# EAGLE design Sensor Acquisition Board Rear rev2 (EAGLE 9.6.2)

## Sheet 1 of 2
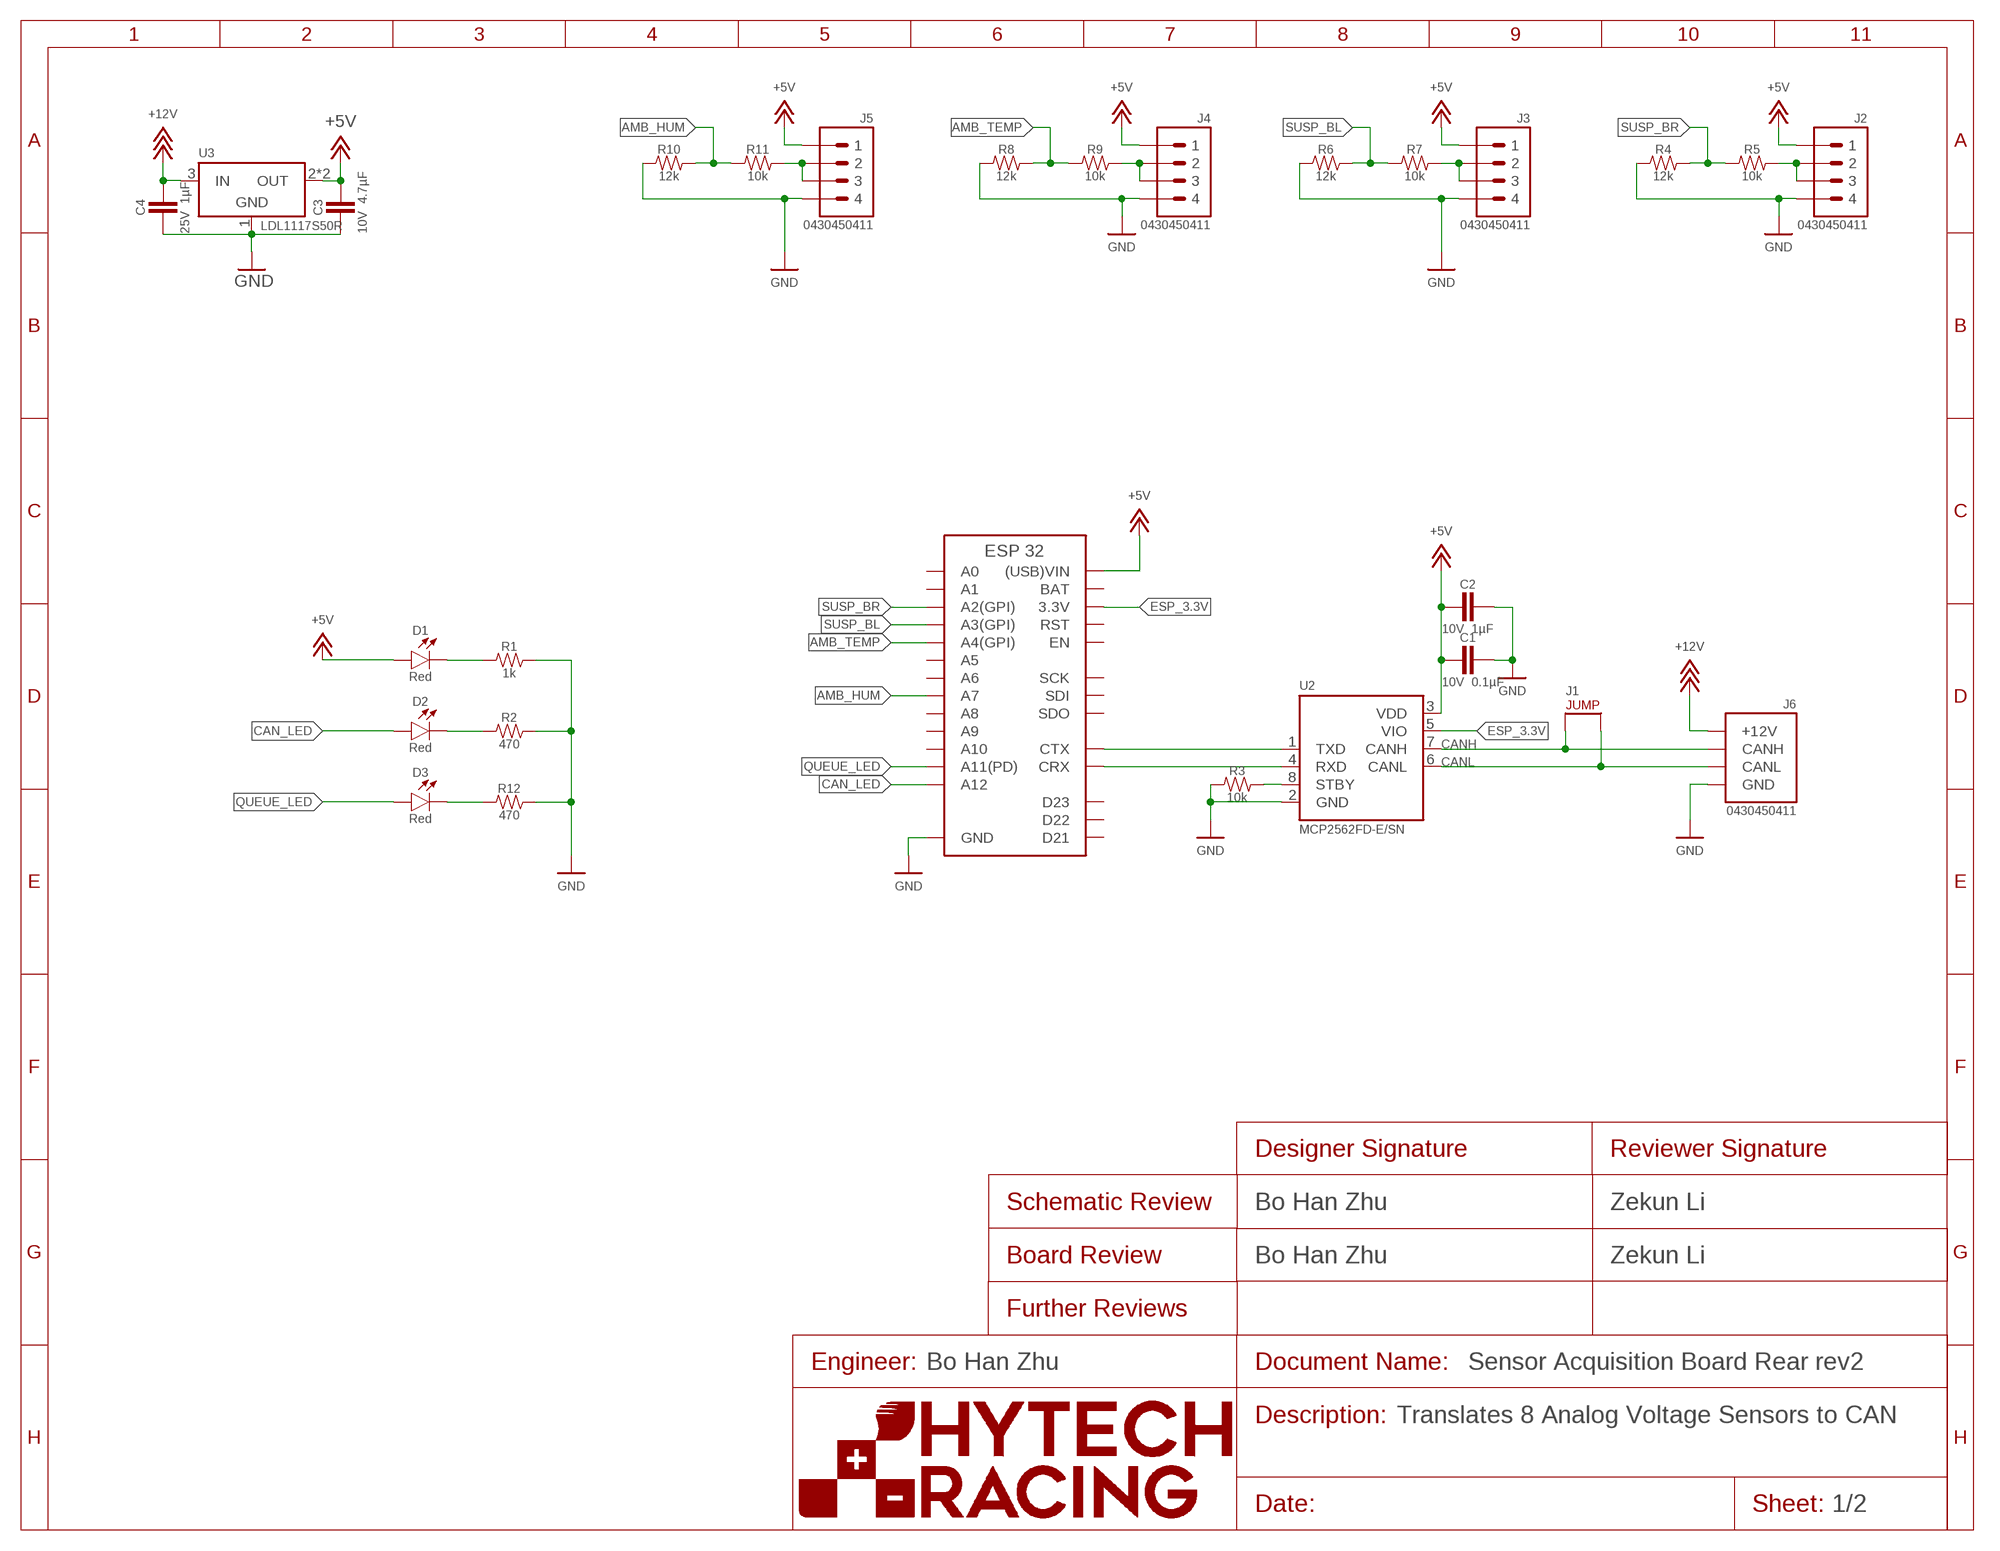
[diagram p0: schematic, sheet 1]
FRAME1 (FRAME): DESCRIPTION_1: Translates 8 Analog Voltage Sensors to CAN; DESIGNER_BOARD: Bo Han Zhu; DESIGNER_SCHEMATIC: Bo Han Zhu; ENGINEER: Bo Han Zhu; REVIEWER_BOARD: Zekun Li; REVIEWER_SCHEMATIC: Zekun Li

### Parts
A2  ESP32  [ESP32]
C1  CAPACITOR_0603_10V_0.1UF  [0603-CAP]
C2  CAPACITOR_0603_10V_1UF  [0603-CAP]
C3  CAPACITOR_0603_10V_4.7UF  [0603-CAP]
C4  CAPACITOR_0603_25V_1UF  [0603-CAP]
D1  LED_0603_RED  [0603-LED]
D2  LED_0603_RED  [0603-LED]
D3  LED_0603_RED  [0603-LED]
J1  JUMPER_0603_  [0603-RES]
J2  CONNECTOR-4_μF_S_RA_  [MOLEX_MICROFIT_SMD_RIGHTANGLE_04_DUAL]
J3  CONNECTOR-4_μF_S_RA_  [MOLEX_MICROFIT_SMD_RIGHTANGLE_04_DUAL]
J4  CONNECTOR-4_μF_S_RA_  [MOLEX_MICROFIT_SMD_RIGHTANGLE_04_DUAL]
J5  CONNECTOR-4_μF_S_RA_  [MOLEX_MICROFIT_SMD_RIGHTANGLE_04_DUAL]
J6  CONNECTOR-CAN_μF_S_RA_  [MOLEX_MICROFIT_SMD_RIGHTANGLE_04_DUAL]
R1  RESISTOR_0603_1K  [0603-RES]
R2  RESISTOR_0603_470  [0603-RES]
R3  RESISTOR_0603_10K  [0603-RES]
R4  RESISTOR_0603_12K  [0603-RES]
R5  RESISTOR_0603_10K  [0603-RES]
R6  RESISTOR_0603_12K  [0603-RES]
R7  RESISTOR_0603_10K  [0603-RES]
R8  RESISTOR_0603_12K  [0603-RES]
R9  RESISTOR_0603_10K  [0603-RES]
R10  RESISTOR_0603_12K  [0603-RES]
R11  RESISTOR_0603_10K  [0603-RES]
R12  RESISTOR_0603_470  [0603-RES]
U2  MCP2562FD  [SOIC-08(NARROW,0.15")]
U3  VOLTAGE_REGULATOR_SOT-223_5V  [SOT-223]

### Nets
+5V: A2.USB((USB)VIN) C1.2 C2.2 C3.1 D1.2(A) J2.1 J3.1 J4.1 J5.1 U2.3(VDD) U3.2(OUT) U3.4(OUT)
+12V: C4.1 J6.1(+12V) U3.3(IN)
AMB_HUM: A2.D32(A7) R10.2 R11.1
AMB_TEMP: A2.A4(A4(GPI)) R8.2 R9.1
CAN_LED: A2.D13(A12) D2.2(A)
CANH: J1.1 J6.4(CANH) U2.7(CANH)
CANL: J1.2 J6.3(CANL) U2.6(CANL)
ESP_3.3V: A2.3.3V U2.5(VIO)
GND: A2.GND C1.1 C2.1 C3.2 C4.2 J2.4 J3.4 J4.4 J5.4 J6.2(GND) R1.2 R2.2 R3.1 R4.1 R6.1 R8.1 R10.1 R12.2 U2.2(GND) U3.1(GND)
N$1: D1.1(C) R1.1
N$2: D2.1(C) R2.1
N$3: R3.2 U2.8(STBY)
N$4: A2.TX(CTX) U2.1(TXD)
N$5: J2.2 J2.3 R5.2
N$6: J4.2 J4.3 R9.2
N$7: J3.2 J3.3 R7.2
N$8: A2.RX(CRX) U2.4(RXD)
N$9: J5.2 J5.3 R11.2
N$10: D3.1(C) R12.1
QUEUE_LED: A2.D12(A11(PD)) D3.2(A)
SUSP_BL: A2.A3(A3(GPI)) R6.2 R7.1
SUSP_BR: A2.A2(A2(GPI)) R4.2 R5.1
Unconnected: A2.A0 A2.A1 A2.A5 A2.CIPO(SDI) A2.COPI(SDO) A2.D14(A6) A2.D15(A8) A2.D21 A2.D27(A10) A2.D33(A9) A2.SCK A2.SCL(D23) A2.SDA(D22)

## Sheet 2 of 2
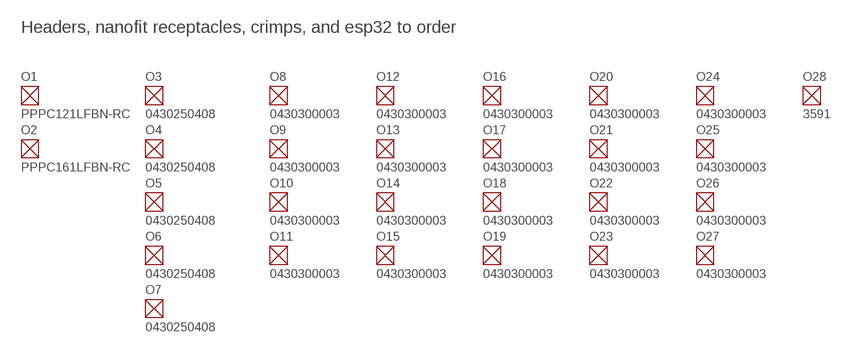
[diagram p1: schematic, sheet 2]
O1 (HEADER_FEMALE_PINS_12_0.1"_PITCH): DKPN: S7045-ND; MANUFACTURER: Sullins Connector Solutions; MPN: PPPC121LFBN-RC
O2 (HEADER_FEMALE_PINS_16_0.1"_PITCH): DKPN: S7049-ND; MANUFACTURER: Sullins Connector Solutions; MPN: PPPC161LFBN-RC
O3 (RECEPTACLE-4_MICROFIT): DKPN: WM11225-ND; MANUFACTURER: Molex; MOPN: 538-43025-0408; MPN: 0430250408
O4 (RECEPTACLE-4_MICROFIT): DKPN: WM11225-ND; MANUFACTURER: Molex; MOPN: 538-43025-0408; MPN: 0430250408
O5 (RECEPTACLE-4_MICROFIT): DKPN: WM11225-ND; MANUFACTURER: Molex; MOPN: 538-43025-0408; MPN: 0430250408
O6 (RECEPTACLE-4_MICROFIT): DKPN: WM11225-ND; MANUFACTURER: Molex; MOPN: 538-43025-0408; MPN: 0430250408
O7 (RECEPTACLE-4_MICROFIT): DKPN: WM11225-ND; MANUFACTURER: Molex; MOPN: 538-43025-0408; MPN: 0430250408
O8 (CRIMP_MICROFIT_20-24): DKPN: WM2776CT-ND; GAUGE: 20-24; MANUFACTURER: Molex; MOPN: 538-43030-0003; MPN: 0430300003
O9 (CRIMP_MICROFIT_20-24): DKPN: WM2776CT-ND; GAUGE: 20-24; MANUFACTURER: Molex; MOPN: 538-43030-0003; MPN: 0430300003
O10 (CRIMP_MICROFIT_20-24): DKPN: WM2776CT-ND; GAUGE: 20-24; MANUFACTURER: Molex; MOPN: 538-43030-0003; MPN: 0430300003
O11 (CRIMP_MICROFIT_20-24): DKPN: WM2776CT-ND; GAUGE: 20-24; MANUFACTURER: Molex; MOPN: 538-43030-0003; MPN: 0430300003
O12 (CRIMP_MICROFIT_20-24): DKPN: WM2776CT-ND; GAUGE: 20-24; MANUFACTURER: Molex; MOPN: 538-43030-0003; MPN: 0430300003
O13 (CRIMP_MICROFIT_20-24): DKPN: WM2776CT-ND; GAUGE: 20-24; MANUFACTURER: Molex; MOPN: 538-43030-0003; MPN: 0430300003
O14 (CRIMP_MICROFIT_20-24): DKPN: WM2776CT-ND; GAUGE: 20-24; MANUFACTURER: Molex; MOPN: 538-43030-0003; MPN: 0430300003
O15 (CRIMP_MICROFIT_20-24): DKPN: WM2776CT-ND; GAUGE: 20-24; MANUFACTURER: Molex; MOPN: 538-43030-0003; MPN: 0430300003
O16 (CRIMP_MICROFIT_20-24): DKPN: WM2776CT-ND; GAUGE: 20-24; MANUFACTURER: Molex; MOPN: 538-43030-0003; MPN: 0430300003
O17 (CRIMP_MICROFIT_20-24): DKPN: WM2776CT-ND; GAUGE: 20-24; MANUFACTURER: Molex; MOPN: 538-43030-0003; MPN: 0430300003
O18 (CRIMP_MICROFIT_20-24): DKPN: WM2776CT-ND; GAUGE: 20-24; MANUFACTURER: Molex; MOPN: 538-43030-0003; MPN: 0430300003
O19 (CRIMP_MICROFIT_20-24): DKPN: WM2776CT-ND; GAUGE: 20-24; MANUFACTURER: Molex; MOPN: 538-43030-0003; MPN: 0430300003
O20 (CRIMP_MICROFIT_20-24): DKPN: WM2776CT-ND; GAUGE: 20-24; MANUFACTURER: Molex; MOPN: 538-43030-0003; MPN: 0430300003
O21 (CRIMP_MICROFIT_20-24): DKPN: WM2776CT-ND; GAUGE: 20-24; MANUFACTURER: Molex; MOPN: 538-43030-0003; MPN: 0430300003
O22 (CRIMP_MICROFIT_20-24): DKPN: WM2776CT-ND; GAUGE: 20-24; MANUFACTURER: Molex; MOPN: 538-43030-0003; MPN: 0430300003
O23 (CRIMP_MICROFIT_20-24): DKPN: WM2776CT-ND; GAUGE: 20-24; MANUFACTURER: Molex; MOPN: 538-43030-0003; MPN: 0430300003
O24 (CRIMP_MICROFIT_20-24): DKPN: WM2776CT-ND; GAUGE: 20-24; MANUFACTURER: Molex; MOPN: 538-43030-0003; MPN: 0430300003
O25 (CRIMP_MICROFIT_20-24): DKPN: WM2776CT-ND; GAUGE: 20-24; MANUFACTURER: Molex; MOPN: 538-43030-0003; MPN: 0430300003
O26 (CRIMP_MICROFIT_20-24): DKPN: WM2776CT-ND; GAUGE: 20-24; MANUFACTURER: Molex; MOPN: 538-43030-0003; MPN: 0430300003
O27 (CRIMP_MICROFIT_20-24): DKPN: WM2776CT-ND; GAUGE: 20-24; MANUFACTURER: Molex; MOPN: 538-43030-0003; MPN: 0430300003
O28 (ESP32): DKPN: 1528-2514-ND; MANUFACTURER: Adafruit Industries LLC; MPN: 3591

### Notes on the sheet
- Headers, nanofit receptacles, crimps, and esp32 to order

## Power pins joined to a net without a drawn wire
BAT: A2.BAT
EN: A2.EN
RST: A2.RST

## Library data of the parts
A2 = HyTechDevicesTemp:ESP32: ESP32 Datasheet <https://cdn-learn.adafruit.com/downloads/pdf/adafruit-huzzah32-esp32-feather.pdf> Requires ordering of: 1: 12 pin, 0.1" pitch female headers 1: 16 pin, 0.1" pitch female headers
C1 = HyTechDevices:CAPACITOR_?_*: Capacitor, Non-Polarized VJ...1BC Series Datasheet <https://www.mouser.com/datasheet/2/427/vjw1bcbascomseries-1762447.pdf> Samsung Datasheet <https://www.mouser.com/datasheet/2/585/MLCC-1837944.pdf> Walsin Datasheet <https://www.mouser.com/datasheet/2/210/WTC_MLCC_General_Purpose-1534899.pdf> GRM188R61A226ME15D <https://www.mouser.com/datasheet/2/281/1/GRM188R61A226ME15_02A-1985787.pdf> GRM188R61E106MA73D <https://www.mouser.com/datasheet/2/281/1/GRM188R61E106MA73_01A-1985806.pdf> 885012006013 <https://www.mouser.com/datasheet/2/445/885012006013-1726946.pdf> 2220Y6300105KXTWS2 <https://www.mouser.com/datasheet/2/218/SMD_High_and_Std_StackiCap_P62-1825512.pdf> Yageo Class 2, X5R <https://www.mouser.com/datasheet/2/447/UPY_GPHC_X5R_4V_to_50V_26-1827097.pdf> TDK C Series <https://www.mouser.com/ProductDetail/TDK/C3216X5R1V226M160AC?qs=%2Fha2pyFadujbcx9jh7lYl%2F4NeMoXFhdc8AqVWNq4wW6M2y7zl6GzBuhgtI0ngznN> AVX Automotive MLCC <https://www.mouser.com/datasheet/2/40/AutoMLCC-777028.pdf> KEMET X7R Series <https://www.mouser.com/datasheet/2/212/KEM_C1002_X7R_SMD-1102033.pdf> Kyocera AVX <https://www.mouser.com/datasheet/2/40/C0GNP0_Dielectric-951274.pdf>; CAPACITANCE: 0.1µF; DKPN: 720-1688-1-ND; MANUFACTURER: Vishay Vitramon; MOPN: 77-VJ0603Y104JXQPBC; MPN: VJ0603Y104JXQPW1BC; TOLERANCE: 5%; VOLTAGE: 10V
C2 = HyTechDevices:CAPACITOR_?_*: Capacitor, Non-Polarized VJ...1BC Series Datasheet <https://www.mouser.com/datasheet/2/427/vjw1bcbascomseries-1762447.pdf> Samsung Datasheet <https://www.mouser.com/datasheet/2/585/MLCC-1837944.pdf> Walsin Datasheet <https://www.mouser.com/datasheet/2/210/WTC_MLCC_General_Purpose-1534899.pdf> GRM188R61A226ME15D <https://www.mouser.com/datasheet/2/281/1/GRM188R61A226ME15_02A-1985787.pdf> GRM188R61E106MA73D <https://www.mouser.com/datasheet/2/281/1/GRM188R61E106MA73_01A-1985806.pdf> 885012006013 <https://www.mouser.com/datasheet/2/445/885012006013-1726946.pdf> 2220Y6300105KXTWS2 <https://www.mouser.com/datasheet/2/218/SMD_High_and_Std_StackiCap_P62-1825512.pdf> Yageo Class 2, X5R <https://www.mouser.com/datasheet/2/447/UPY_GPHC_X5R_4V_to_50V_26-1827097.pdf> TDK C Series <https://www.mouser.com/ProductDetail/TDK/C3216X5R1V226M160AC?qs=%2Fha2pyFadujbcx9jh7lYl%2F4NeMoXFhdc8AqVWNq4wW6M2y7zl6GzBuhgtI0ngznN> AVX Automotive MLCC <https://www.mouser.com/datasheet/2/40/AutoMLCC-777028.pdf> KEMET X7R Series <https://www.mouser.com/datasheet/2/212/KEM_C1002_X7R_SMD-1102033.pdf> Kyocera AVX <https://www.mouser.com/datasheet/2/40/C0GNP0_Dielectric-951274.pdf>; CAPACITANCE: 1µF; DKPN: 311-1796-1-ND; MANUFACTURER: Yageo; MOPN: 603-CC603KRX7R6BB105; MPN: CC0603KRX7R6BB105; TOLERANCE: 10%; VOLTAGE: 10V
C3 = HyTechDevices:CAPACITOR_?_*: Capacitor, Non-Polarized VJ...1BC Series Datasheet <https://www.mouser.com/datasheet/2/427/vjw1bcbascomseries-1762447.pdf> Samsung Datasheet <https://www.mouser.com/datasheet/2/585/MLCC-1837944.pdf> Walsin Datasheet <https://www.mouser.com/datasheet/2/210/WTC_MLCC_General_Purpose-1534899.pdf> GRM188R61A226ME15D <https://www.mouser.com/datasheet/2/281/1/GRM188R61A226ME15_02A-1985787.pdf> GRM188R61E106MA73D <https://www.mouser.com/datasheet/2/281/1/GRM188R61E106MA73_01A-1985806.pdf> 885012006013 <https://www.mouser.com/datasheet/2/445/885012006013-1726946.pdf> 2220Y6300105KXTWS2 <https://www.mouser.com/datasheet/2/218/SMD_High_and_Std_StackiCap_P62-1825512.pdf> Yageo Class 2, X5R <https://www.mouser.com/datasheet/2/447/UPY_GPHC_X5R_4V_to_50V_26-1827097.pdf> TDK C Series <https://www.mouser.com/ProductDetail/TDK/C3216X5R1V226M160AC?qs=%2Fha2pyFadujbcx9jh7lYl%2F4NeMoXFhdc8AqVWNq4wW6M2y7zl6GzBuhgtI0ngznN> AVX Automotive MLCC <https://www.mouser.com/datasheet/2/40/AutoMLCC-777028.pdf> KEMET X7R Series <https://www.mouser.com/datasheet/2/212/KEM_C1002_X7R_SMD-1102033.pdf> Kyocera AVX <https://www.mouser.com/datasheet/2/40/C0GNP0_Dielectric-951274.pdf>; CAPACITANCE: 4.7µF; DKPN: 1276-1044-1-ND; MANUFACTURER: Samsung Electro-Mechanics; MOPN: 187-CL10A475KP8NNNC; MPN: CL10A475KP8NNNC; TOLERANCE: 10%; VOLTAGE: 10V
C4 = HyTechDevices:CAPACITOR_?_*: Capacitor, Non-Polarized VJ...1BC Series Datasheet <https://www.mouser.com/datasheet/2/427/vjw1bcbascomseries-1762447.pdf> Samsung Datasheet <https://www.mouser.com/datasheet/2/585/MLCC-1837944.pdf> Walsin Datasheet <https://www.mouser.com/datasheet/2/210/WTC_MLCC_General_Purpose-1534899.pdf> GRM188R61A226ME15D <https://www.mouser.com/datasheet/2/281/1/GRM188R61A226ME15_02A-1985787.pdf> GRM188R61E106MA73D <https://www.mouser.com/datasheet/2/281/1/GRM188R61E106MA73_01A-1985806.pdf> 885012006013 <https://www.mouser.com/datasheet/2/445/885012006013-1726946.pdf> 2220Y6300105KXTWS2 <https://www.mouser.com/datasheet/2/218/SMD_High_and_Std_StackiCap_P62-1825512.pdf> Yageo Class 2, X5R <https://www.mouser.com/datasheet/2/447/UPY_GPHC_X5R_4V_to_50V_26-1827097.pdf> TDK C Series <https://www.mouser.com/ProductDetail/TDK/C3216X5R1V226M160AC?qs=%2Fha2pyFadujbcx9jh7lYl%2F4NeMoXFhdc8AqVWNq4wW6M2y7zl6GzBuhgtI0ngznN> AVX Automotive MLCC <https://www.mouser.com/datasheet/2/40/AutoMLCC-777028.pdf> KEMET X7R Series <https://www.mouser.com/datasheet/2/212/KEM_C1002_X7R_SMD-1102033.pdf> Kyocera AVX <https://www.mouser.com/datasheet/2/40/C0GNP0_Dielectric-951274.pdf>; CAPACITANCE: 1µF; DKPN: 1276-1184-1-ND; MANUFACTURER: Samsung Electro-Mechanics; MOPN: 187-CL10B105KA8NNNC; MPN: CL10B105KA8NNNC; TOLERANCE: 10%; VOLTAGE: 25V
D1-D3 = HyTechDevices:LED_?_*: LED 0603 Blue <https://www.mouser.com/datasheet/2/216/APT1608VBC_D-246010.pdf> Green <https://www.mouser.com/datasheet/2/216/APT1608ZGCK-1173388.pdf> Orange <https://www.mouser.com/datasheet/2/216/APT1608SECK-6197.pdf> Red <https://www.mouser.com/datasheet/2/216/APT1608SECK-J3-PRV-1173336.pdf> White <https://www.mouser.com/datasheet/2/50/SM0603UWC-880813.pdf> Yellow <https://www.mouser.com/datasheet/2/216/APT1608SYCK-J3-PRV-1173311.pdf> 2835 (Series not on Digikey) Lumiled LUXEON 2835 Color Line <https://www.mouser.com/datasheet/2/602/DS236_luxeon_2835_color_line_datasheet-1596094.pdf>; COLOR: Red; DKPN: 754-1786-1-ND; MANUFACTURER: Kingbright; MOPN: 604-APT1608SECKJ3PRV; MPN: APT1608SECK/J3-PRV
J1 = HyTechDevices:JUMPER_?_*: 2 Pin Connector; DKPN: 13-RC0603FR-130RLTR-ND; MANUFACTURER: YAGEO; MOPN: 603-RC0603FR-130RL; MPN: RC0603FR-130RL
J2-J5 = HyTechDevices:CONNECTOR-4_?_*; DKPN: WM1832CT-ND; MANUFACTURER: Molex; MOPN: 538-0430450411; MPN: 0430450411
J6 = HyTechDevices:CONNECTOR-CAN_?_*: HyTech CAN Connector; DKPN: WM1832CT-ND; MANUFACTURER: Molex; MOPN: 538-43045-0411; MPN: 0430450411
R1 = HyTechDevices:RESISTOR_?_*: Resistor PWR163 Series <https://www.mouser.com/datasheet/2/54/pwr163-777985.pdf> AC Series <https://www.mouser.com/datasheet/2/447/Yageo_PYu_AC_51_RoHS_L_7_1714230-1874691.pdf> PU Series <https://www.mouser.com/datasheet/2/447/PYu-PU_51_RoHS_L_6-1504619.pdf> ERA Series <https://www.mouser.com/datasheet/2/315/AOA0000C307-1149632.pdf> PWR263 Series <https://www.mouser.com/datasheet/2/54/pwr263s_35-778069.pdf> RC Series <https://www.mouser.com/datasheet/2/447/Yageo_03_18_2021_PYu_RC_Group_51_RoHS_L_11-2199992.pdf> ERJ PB3, PB6 Series <https://www.mouser.com/datasheet/2/315/AOA0000C328-1530132.pdf> ERJ PA2, P03, PA3, P06, P08, P14 Series <https://www.mouser.com/datasheet/2/315/AOA0000C331-1141874.pdf>; DKPN: 311-1.00KHRCT-ND; MANUFACTURER: Yageo; MOPN: 603-RC0603FR-071KL; MPN: RC0603FR-071KL; POWER: 0.1W; RESISTANCE: 1k; TOLERANCE: 1%; VOLTAGE_CONTINUOUS: 10.00V; VOLTAGE_MAX: 75V
R2 R12 = HyTechDevices:RESISTOR_?_*: Resistor PWR163 Series <https://www.mouser.com/datasheet/2/54/pwr163-777985.pdf> AC Series <https://www.mouser.com/datasheet/2/447/Yageo_PYu_AC_51_RoHS_L_7_1714230-1874691.pdf> PU Series <https://www.mouser.com/datasheet/2/447/PYu-PU_51_RoHS_L_6-1504619.pdf> ERA Series <https://www.mouser.com/datasheet/2/315/AOA0000C307-1149632.pdf> PWR263 Series <https://www.mouser.com/datasheet/2/54/pwr263s_35-778069.pdf> RC Series <https://www.mouser.com/datasheet/2/447/Yageo_03_18_2021_PYu_RC_Group_51_RoHS_L_11-2199992.pdf> ERJ PB3, PB6 Series <https://www.mouser.com/datasheet/2/315/AOA0000C328-1530132.pdf> ERJ PA2, P03, PA3, P06, P08, P14 Series <https://www.mouser.com/datasheet/2/315/AOA0000C331-1141874.pdf>; DKPN: P470BYCT-ND; MANUFACTURER: Panasonic Electronic Components; MOPN: 667-ERJ-PA3F4700V; MPN: ERJ-PA3F4700V; POWER: 0.25W; RESISTANCE: 470; TOLERANCE: 1%; VOLTAGE_CONTINUOUS: 10.84V; VOLTAGE_MAX: 150V
R3 R5 R7 R9 R11 = HyTechDevices:RESISTOR_?_*: Resistor PWR163 Series <https://www.mouser.com/datasheet/2/54/pwr163-777985.pdf> AC Series <https://www.mouser.com/datasheet/2/447/Yageo_PYu_AC_51_RoHS_L_7_1714230-1874691.pdf> PU Series <https://www.mouser.com/datasheet/2/447/PYu-PU_51_RoHS_L_6-1504619.pdf> ERA Series <https://www.mouser.com/datasheet/2/315/AOA0000C307-1149632.pdf> PWR263 Series <https://www.mouser.com/datasheet/2/54/pwr263s_35-778069.pdf> RC Series <https://www.mouser.com/datasheet/2/447/Yageo_03_18_2021_PYu_RC_Group_51_RoHS_L_11-2199992.pdf> ERJ PB3, PB6 Series <https://www.mouser.com/datasheet/2/315/AOA0000C328-1530132.pdf> ERJ PA2, P03, PA3, P06, P08, P14 Series <https://www.mouser.com/datasheet/2/315/AOA0000C331-1141874.pdf>; DKPN: 311-10.0KHRCT-ND; MANUFACTURER: Yageo; MOPN: 603-RC0603FR-0710KL; MPN: RC0603FR-0710KL; POWER: 0.1W; RESISTANCE: 10k; TOLERANCE: 1%; VOLTAGE_CONTINUOUS: 31.62V; VOLTAGE_MAX: 75V
R4 R6 R8 R10 = HyTechDevices:RESISTOR_?_*: Resistor PWR163 Series <https://www.mouser.com/datasheet/2/54/pwr163-777985.pdf> AC Series <https://www.mouser.com/datasheet/2/447/Yageo_PYu_AC_51_RoHS_L_7_1714230-1874691.pdf> PU Series <https://www.mouser.com/datasheet/2/447/PYu-PU_51_RoHS_L_6-1504619.pdf> ERA Series <https://www.mouser.com/datasheet/2/315/AOA0000C307-1149632.pdf> PWR263 Series <https://www.mouser.com/datasheet/2/54/pwr263s_35-778069.pdf> RC Series <https://www.mouser.com/datasheet/2/447/Yageo_03_18_2021_PYu_RC_Group_51_RoHS_L_11-2199992.pdf> ERJ PB3, PB6 Series <https://www.mouser.com/datasheet/2/315/AOA0000C328-1530132.pdf> ERJ PA2, P03, PA3, P06, P08, P14 Series <https://www.mouser.com/datasheet/2/315/AOA0000C331-1141874.pdf>; DKPN: 311-12.0KHRCT-ND; MANUFACTURER: Yageo; MOPN: 603-RC0603FR-0712KL; MPN: RC0603FR-0712KL; POWER: 0.1W; RESISTANCE: 12k; TOLERANCE: 1%; VOLTAGE_CONTINUOUS: 34.64V; VOLTAGE_MAX: 75V
U2 = HyTechDevices:MCP2562FD: MCP2562FD Can Tranciever Datasheet <https://ww1.microchip.com/downloads/en/DeviceDoc/20005284A.pdf>; ALT_DKPN: MCP2562-E/SN-ND; ALT_MANUFACTURER: Microchip Technology; ALT_MOPN: 579-MCP2562-E/SN; ALT_MPN: MCP2562-E/SN; DKPN: MCP2562FD-E/SN-ND; MANUFACTURER: Microchip Technology; MOPN: 579-MCP2562FD-E/SN; MPN: MCP2562FD-E/SN
U3 = HyTechDevices:VOLTAGE_REGULATOR_?_*: Voltage Regulators LDL1117S50R Datasheet <https://www.mouser.com/datasheet/2/389/dm00366442-1799212.pdf> NCP785AH120T1G <https://www.mouser.com/datasheet/2/308/NCP785A_D-1812704.pdf> LMS8117A Datasheet <https://www.ti.com/lit/ds/symlink/lms8117a.pdf?HQS>; DKPN: 497-17240-1-ND; MANUFACTURER: STMicroelectronics; MOPN: 511-LDL1117S50R; MPN: LDL1117S50R

## Board
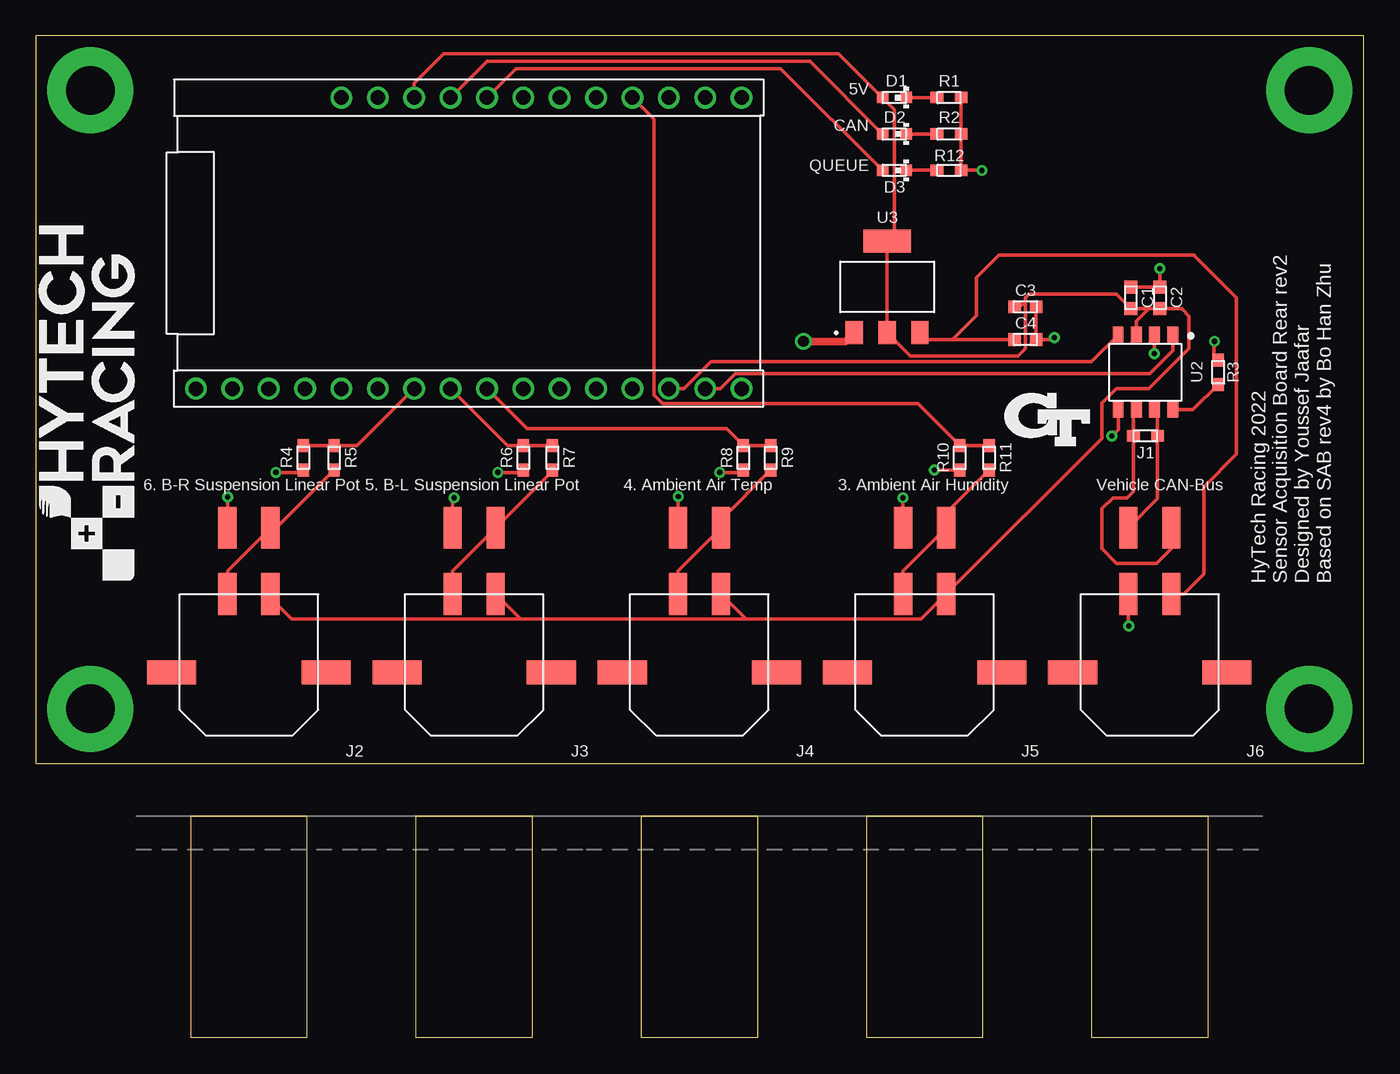
[diagram p2: board, top side]
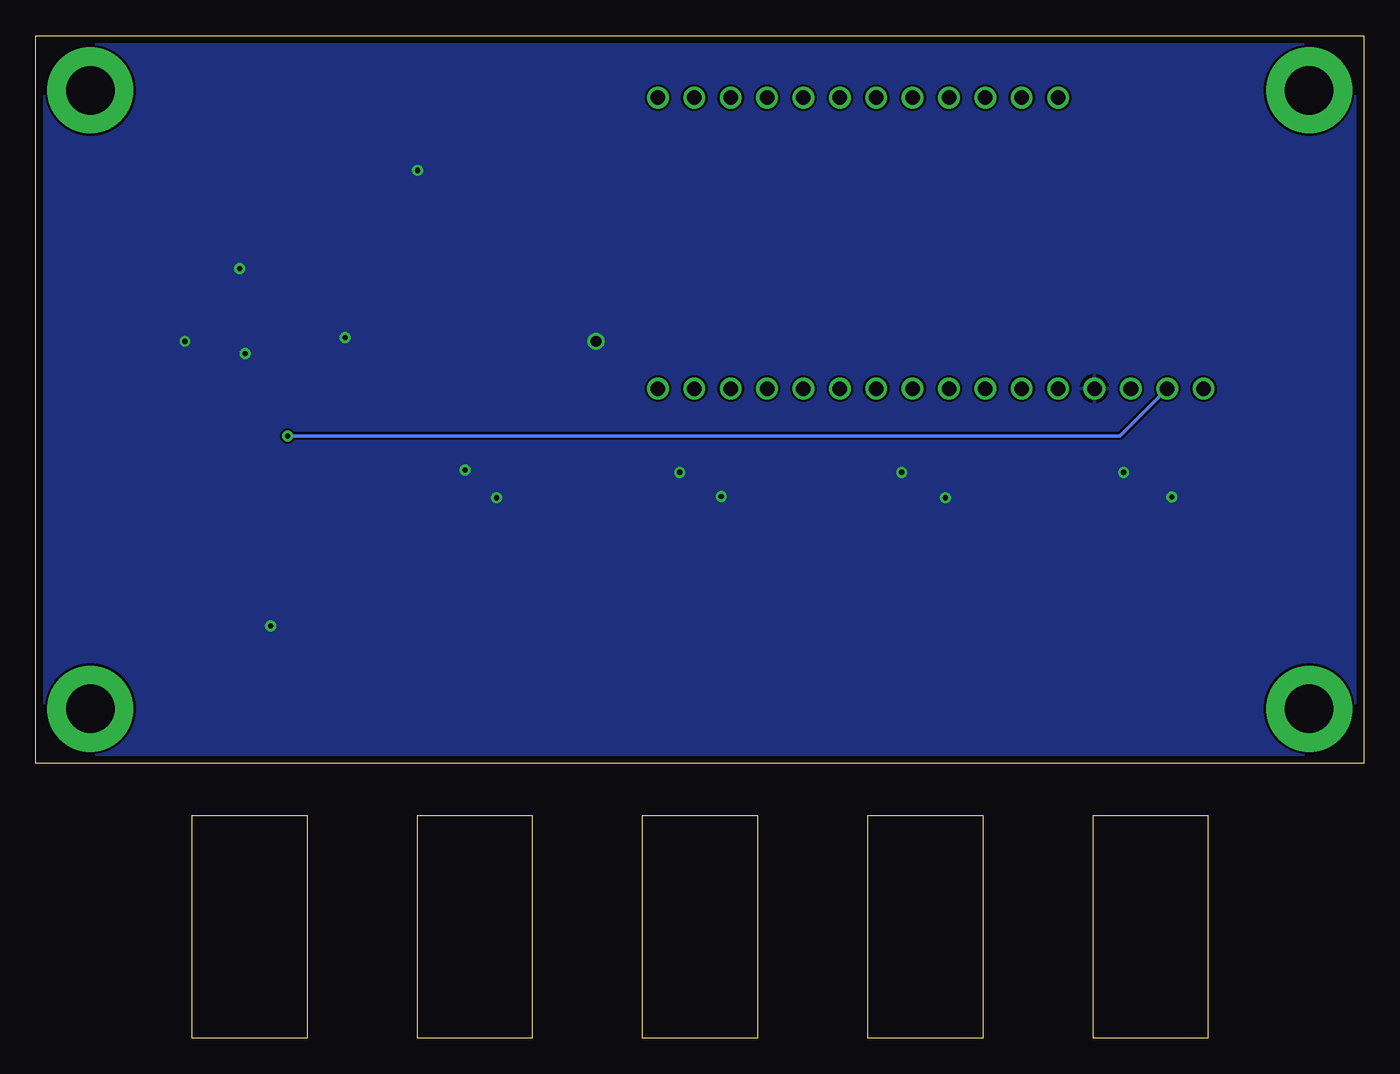
[diagram p3: board, bottom side, seen from below]

Size 92.71 x 50.8 mm. Coordinates in mm from the lower left corner, seen from the top.
Outline: 0,0 92.71,0 92.71,50.8 0,50.8 0,0
Copper layers (1*16): Top 0.035mm / dielectric 1.53mm / Bottom 0.035mm
Design rules "HyTech Default (2 Layer)": minimum track width 6mil, minimum drill 14mil, track to track 6mil, track to pad 6mil, pad to pad 6mil, via to via 20mil, smd to smd 6mil, copper to edge 20mil, drill to drill 21mil, minimum pad ring 7mil, minimum via ring 8mil, stop-mask expansion 6mil, vias tented up to drill 30mil, thermal gap 10mil

### Footprints (pad centres in the part's own frame; a part is rotated, then mirrored left to right if it is on the bottom)
MOUNTING_M3 = drill 3.4 pad 6: 1 0,0
ESP32 = drill 1.016: 3.3V 10.16,2.54; A0 10.16,10.16; A1 10.16,12.7; A2 10.16,15.24; A3 10.16,17.78; A4 10.16,20.32; A5 10.16,22.86; BAT -10.16,10.16; CIPO 10.16,30.48; COPI 10.16,27.94; D12 -10.16,20.32; D13 -10.16,17.78; D14 -10.16,33.02; D15 -10.16,27.94; D21 10.16,38.1; D27 -10.16,22.86; D32 -10.16,30.48; D33 -10.16,25.4; EN -10.16,12.7; GND 10.16,7.62; NC 10.16,5.08; RST 10.16,0; RX 10.16,33.02; SCK 10.16,25.4; SCL -10.16,35.56; SDA -10.16,38.1; TX 10.16,35.56; USB -10.16,15.24
0603-CAP = smd 0.9 x 0.9: 1 -0.75,0; 2 0.75,0
0603-LED = smd 0.8 x 0.8: 1 -0.825,0; 2 0.825,0
0603-RES = smd 0.9 x 0.8: 1 -0.85,0; 2 0.85,0
MOLEX_MICROFIT_SMD_RIGHTANGLE_04_DUAL = smd 1.27 x 2.921: 1 1.5,5.474; 2 -1.5,5.474; 3 1.5,10.097; 4 -1.5,10.097 | smd 3.429 x 1.651: PAD1 5.386,0; PAD2 -5.386,0
SOIC-08(NARROW,0.15") = smd 0.762 x 1.143: 1 -1.905,-2.603; 2 -0.635,-2.603; 3 0.635,-2.603; 4 1.905,-2.603; 5 1.905,2.603; 6 0.635,2.603; 7 -0.635,2.603; 8 -1.905,2.603
SOT-223 = smd 1.2 x 1.6: 1 -2.3,-3.2; 2 0,-3.2; 3 2.3,-3.2 | smd 3.3 x 1.6: 4 0,3.2

### Placement (x,y rotation side)
$$U$6  [MOUNTING_M3]  88.9,3.81 0 top
A2  11.18,36.32 270 top
C1  76.45,32.51 270 top
C2  78.49,32.51 270 top
C3  69.09,31.88 0 top
C4  69.09,29.59 0 top
D1  59.94,46.48 180 top
D2  59.94,43.94 180 top
D3  59.94,41.4 180 top
J1  77.47,22.86 180 top
J2  14.88,6.35 0 top
J3  30.61,6.35 0 top
J4  46.33,6.35 0 top
J5  62.05,6.35 0 top
J6  77.77,6.35 0 top
R1  63.75,46.48 0 top
R2  63.75,43.94 0 top
R3  82.55,27.3 270 top
R4  18.67,21.34 90 top
R5  20.83,21.34 270 top
R6  34.04,21.34 90 top
R7  36.07,21.34 270 top
R8  49.4,21.34 90 top
R9  51.31,21.34 270 top
R10  64.52,21.34 90 top
R11  66.55,21.34 270 top
R12  63.75,41.4 0 top
U2  77.47,27.3 180 top
U3  59.44,33.27 0 top
U$1  [MOUNTING_M3]  3.81,46.99 0 top
U$2  [MOUNTING_M3]  88.9,46.99 0 top
U$3  [LOGO_GT_0.25"]  70.61,24 0 top
U$4  [LOGO_HYTECH_MEDIUM]  6.86,12.7 90 top
U$5  [MOUNTING_M3]  3.81,3.81 0 top

### Tracks (layer width: path | path; a pad name or v marks a point on that pad's centre or on a via)
+5V
  Top 0.254: J2.1 16.38,11.56 17.86,10.08 33.85,10.08 | 49.57,10.08 61.81,10.08 J5.1 74.42,22.69 74.42,25.15 75.44,26.16 77.72,26.16 80.52,28.96 80.52,31.24 80,31.76 C2.2 77.72,31.76 | 49.57,10.08 33.85,10.08 | J3.1 33.85,10.08 | J4.1 49.57,10.08 | 77.72,31.76 C1.2 75.45,32.77 69.34,32.77 69.09,32.51 69.09,32.26 | 77.72,31.76 76.83,30.87 U2.3 | 69.09,32.26 69.09,28.96 68.58,28.45 61.06,28.45 U3.2 U3.4 59.94,36.98 59.94,45.66 D1.2 56.05,49.55 28.47,49.55 26.42,47.5 A2.USB | 69.09,32.26 68.71,31.88 C3.1
+12V
  Top 0.254: J6.1 80.15,11.82 81.53,13.21 81.53,19.3 83.82,21.59 83.82,32.51 80.86,35.47 80.87,35.48 67.23,35.48 65.67,33.92 65.67,31.26 64.01,29.59 | C4.1 64.01,29.59 | 64.01,29.59 62.22,29.59 U3.3
AMB_HUM
  Top 0.254: R11.1 R10.2 61.58,25.12 43.77,25.12 43.16,25.73 43.16,44.98 A2.D32
AMB_TEMP
  Top 0.254: R9.1 R8.2 48.22,23.37 34.29,23.37 A2.A4
CAN_LED
  Top 0.254: A2.D13 31.5,49.02 54.04,49.02 D2.2
CANH
  Top 0.254: U2.7 78.32,24.49 J1.1 78.32,18.49 J6.4
CANL
  Top 0.254: U2.6 76.62,24.49 J1.2 76.62,18.97 76.19,18.54 75.18,18.54 74.42,17.78 74.42,14.99 75.44,13.97 78.23,13.97 79.28,15.01 J6.3
ESP_3.3V  (via drill 0.36)
  Top 0.254: v75.13,22.86 75.56,23.29 U2.5
  Bottom 0.254: A2.3.3V 17.02,22.86 v75.13,22.86
GND  (via drill 0.36, 0.76)
  Top 0.254: R1.2 R2.2 R12.2 v66.04,41.4 | R3.1 82.26,28.45 82.26,29.43 v82.3,29.46 | J5.4 v60.55,18.54 | R4.1 18.5,20.32 v16.76,20.32 | J4.4 44.83,18.59 v44.86,18.62 | J6.2 76.28,9.63 v76.3,9.6 | R6.1 33.87,20.32 v32.26,20.32 | R8.1 49.24,20.32 v47.75,20.32 | R10.1 62.75,20.49 v62.74,20.47 | C1.1 C2.1 v78.49,34.54 | U2.2 78.11,28.63 v78.08,28.6 | C3.2 C4.2 70.99,29.59 v71.12,29.72 | J2.4 v13.38,18.59 v13.39,18.59 | v29.21,18.54 29.11,18.44 J3.4
  Top 0.508: U3.1 56.53,29.46 v53.59,29.46
  pour Bottom: -0.25,-0.25 92.96,-0.25 92.96,51.05 -0.25,51.05
N$1
  Top 0.254: D1.1 R1.1
N$2
  Top 0.254: R2.1 D2.1
N$3
  Top 0.254: U2.8 80.8,24.7 R3.2
N$4
  Top 0.254: U2.1 79.38,28.82 77.76,27.2 48.84,27.2 47.8,26.16 A2.TX
N$5
  Top 0.254: J2.2 13.38,13.45 J2.3 16.79,16.45 R5.2
N$6
  Top 0.254: J4.3 44.83,13.45 J4.2 | J4.3 | R9.2 47.82,17 J4.3
N$7
  Top 0.254: J3.2 29.11,13.45 J3.3 36.07,20.41 R7.2
N$8
  Top 0.254: A2.RX 45.26,26.16 47.14,28.04 73.7,28.04 U2.4
N$9
  Top 0.254: R11.2 63.55,17.49 J5.3 60.55,13.45 J5.2
N$10
  Top 0.254: D3.1 R12.1
QUEUE_LED
  Top 0.254: A2.D12 33.53,48.51 52.01,48.51 D3.2
SUSP_BL
  Top 0.254: R7.1 R6.2 32.93,22.19 A2.A3
SUSP_BR
  Top 0.254: R4.2 R5.1 22.44,22.19 A2.A2

### Text on the board
tPlace: 5V | CAN | QUEUE | 6. B-R Suspension Linear Pot | 5. B-L Suspension Linear Pot | 4. Ambient Air Temp | 3. Ambient Air Humidity | Vehicle CAN-Bus | HyTech Racing 2022 / Sensor Acquisition Board Rear rev2 / Designed by Youssef Jaafar / Based on SAB rev4 by Bo Han Zhu